# EAGLE design Minimal Breakout (EAGLE 6.4)
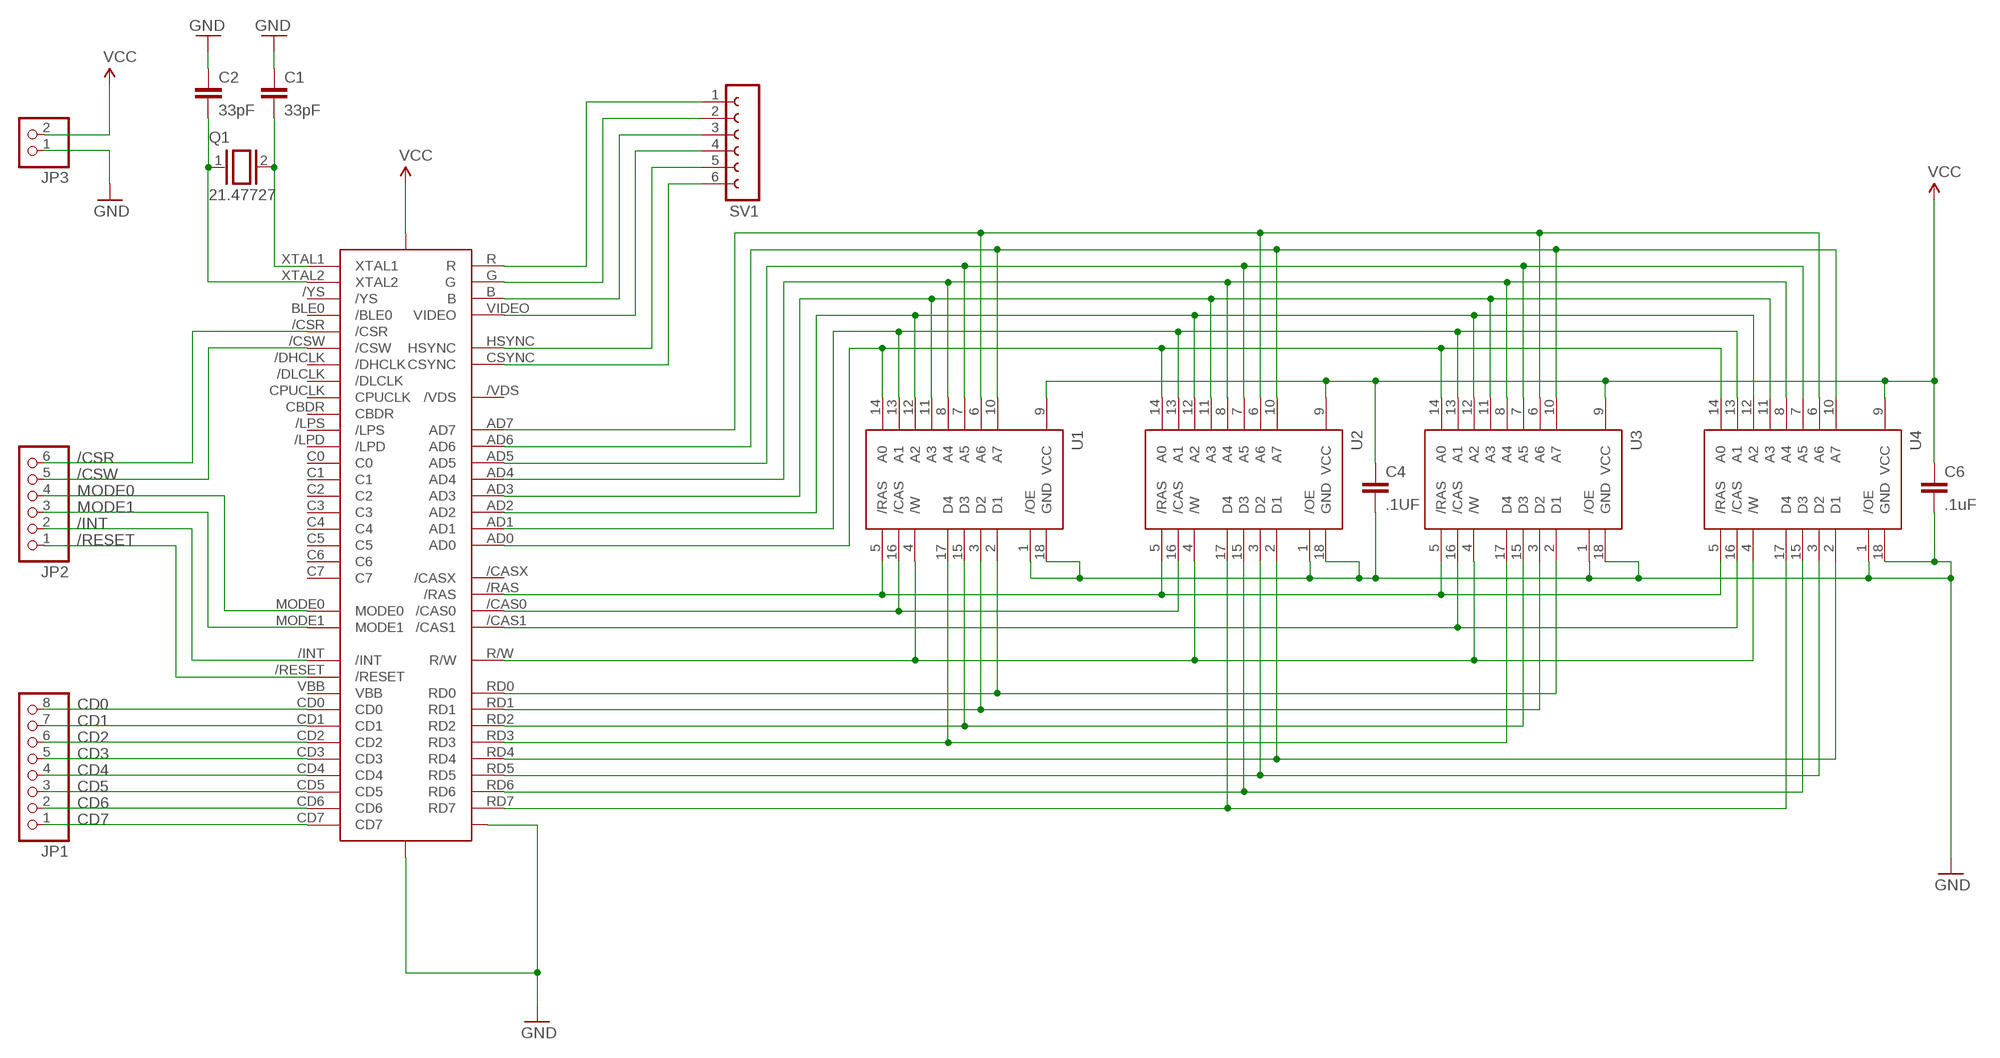
[diagram p0: schematic, sheet 1]

## Parts
C1  33pF  CAPEZ  [CAP-PTH-SMALLEZ]
C2  33pF  CAPEZ  [CAP-PTH-SMALLEZ]
C4  .1UF  CAPEZ  [CAP-PTH-SMALLEZ]
C6  .1uF  CAPEZ  [CAP-PTH-SMALLEZ]
JP1  PINHD-1X8  [1X08]
JP2  PINHD-1X6  [1X06]
JP3  PINHD-1X2  [1X02]
Q1  21.47727  XTAL  [Q]
SV1  FE06-1  [FE06]
U1  41464  [DIL18]
U2  41464  [DIL18]
U3  41464  [DIL18]
U4  41464  [DIL18]
V99X8  V99X8  [V99X8]

## Nets
/CAS0: U1.16(/CAS) U2.16(/CAS) V99X8./CAS0
/CAS1: U3.16(/CAS) U4.16(/CAS) V99X8./CAS1
/CSR: JP2.6 V99X8./CSR
/CSW: JP2.5 V99X8./CSW
/INT: JP2.2 V99X8./INT
/RAS: U1.5(/RAS) U2.5(/RAS) U3.5(/RAS) U4.5(/RAS) V99X8./RAS
/RESET: JP2.1 V99X8./RESET
AD0: U1.14(A0) U2.14(A0) U3.14(A0) U4.14(A0) V99X8.AD0
AD1: U1.13(A1) U2.13(A1) U3.13(A1) U4.13(A1) V99X8.AD1
AD2: U1.12(A2) U2.12(A2) U3.12(A2) U4.12(A2) V99X8.AD2
AD3: U1.11(A3) U2.11(A3) U3.11(A3) U4.11(A3) V99X8.AD3
AD4: U1.8(A4) U2.8(A4) U3.8(A4) U4.8(A4) V99X8.AD4
AD5: U1.7(A5) U2.7(A5) U3.7(A5) U4.7(A5) V99X8.AD5
AD6: U1.10(A7) U2.10(A7) U3.10(A7) U4.10(A7) V99X8.AD6
AD7: U1.6(A6) U2.6(A6) U3.6(A6) U4.6(A6) V99X8.AD7
B: SV1.3 V99X8.B
CD0: JP1.8 V99X8.CD0
CD1: JP1.7 V99X8.CD1
CD2: JP1.6 V99X8.CD2
CD3: JP1.5 V99X8.CD3
CD4: JP1.4 V99X8.CD4
CD5: JP1.3 V99X8.CD5
CD6: JP1.2 V99X8.CD6
CD7: JP1.1 V99X8.CD7
CSYNC: SV1.6 V99X8.CSYNC
G: SV1.2 V99X8.G
GND: C1.1 C2.1 C4.2 C6.2 JP3.1 U1.1(/OE) U1.18(GND) U2.1(/OE) U2.18(GND) U3.1(/OE) U3.18(GND) U4.1(/OE) U4.18(GND) V99X8.GND V99X8.GND/DAC(GNDDAC)
HSYNC: SV1.5 V99X8.HSYNC
MODE0: JP2.4 V99X8.MODE0
MODE1: JP2.3 V99X8.MODE1
N$1: C1.2 Q1.2 V99X8.XTAL1
N$2: C2.2 Q1.1 V99X8.XTAL2
R: SV1.1 V99X8.R
R/W: U1.4(/W) U2.4(/W) U3.4(/W) U4.4(/W) V99X8.R/W
RD0: U1.2(D1) U3.2(D1) V99X8.RD0
RD1: U1.3(D2) U3.3(D2) V99X8.RD1
RD2: U1.15(D3) U3.15(D3) V99X8.RD2
RD3: U1.17(D4) U3.17(D4) V99X8.RD3
RD4: U2.2(D1) U4.2(D1) V99X8.RD4
RD5: U2.3(D2) U4.3(D2) V99X8.RD5
RD6: U2.15(D3) U4.15(D3) V99X8.RD6
RD7: U2.17(D4) U4.17(D4) V99X8.RD7
VCC: C4.1 C6.1 JP3.2 U1.9(VCC) U2.9(VCC) U3.9(VCC) U4.9(VCC)
VIDEO: SV1.4 V99X8.VIDEO
Unconnected: V99X8./CASX V99X8./DHCLK V99X8./DLCLK V99X8./LPD V99X8./LPS V99X8./VDS V99X8./YS V99X8.BLE0(/BLE0) V99X8.C0 V99X8.C1 V99X8.C2 V99X8.C3 V99X8.C4 V99X8.C5 V99X8.C6 V99X8.C7 V99X8.CBDR V99X8.CPUCLK

## Power pins joined to a net without a drawn wire
VBB: V99X8.VBB
VCC: V99X8.VCC

## Library data of the parts
C1 C2 C4 C6 = SparkFun-Capacitors:CAP: Capacitor Standard 0603 ceramic capacitor, and 0.1" leaded capacitor.
JP1 = pinhead:PINHD-1X8: PIN HEADER
JP2 = pinhead:PINHD-1X6: PIN HEADER
JP3 = pinhead:PINHD-1X2: PIN HEADER
Q1 = special:XTAL: CRYSTAL
SV1 = con-lsta:FE06-1: FEMALE HEADER; OC_FARNELL: unknown; OC_NEWARK: unknown
U1-U4 = Benchoff:41464: 41464 64kx4 DRAM
V99X8 = Benchoff:V99X8: Yamaha V99X8 64 pin DIP V9918 V9938 V9958

## Board
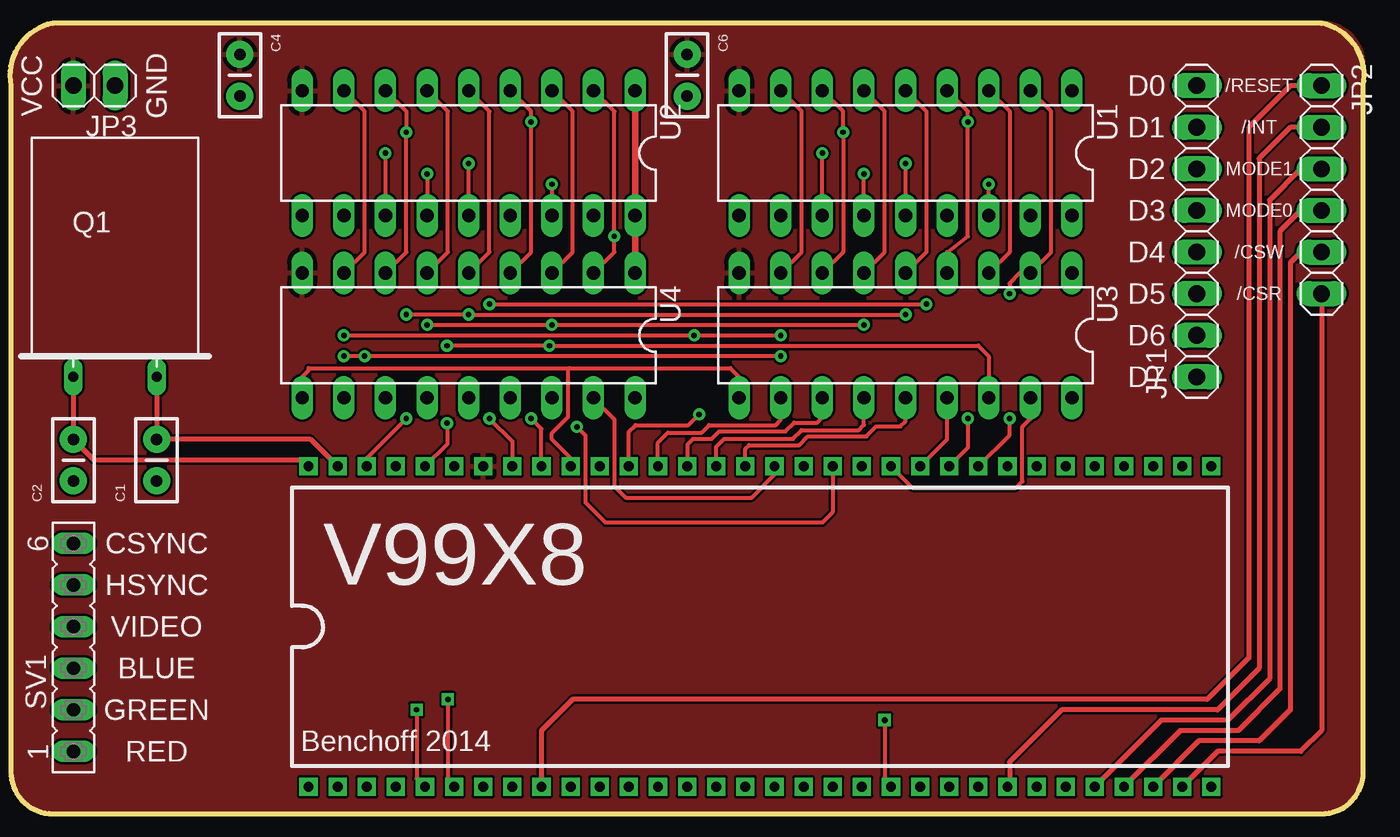
[diagram p1: board, top side]
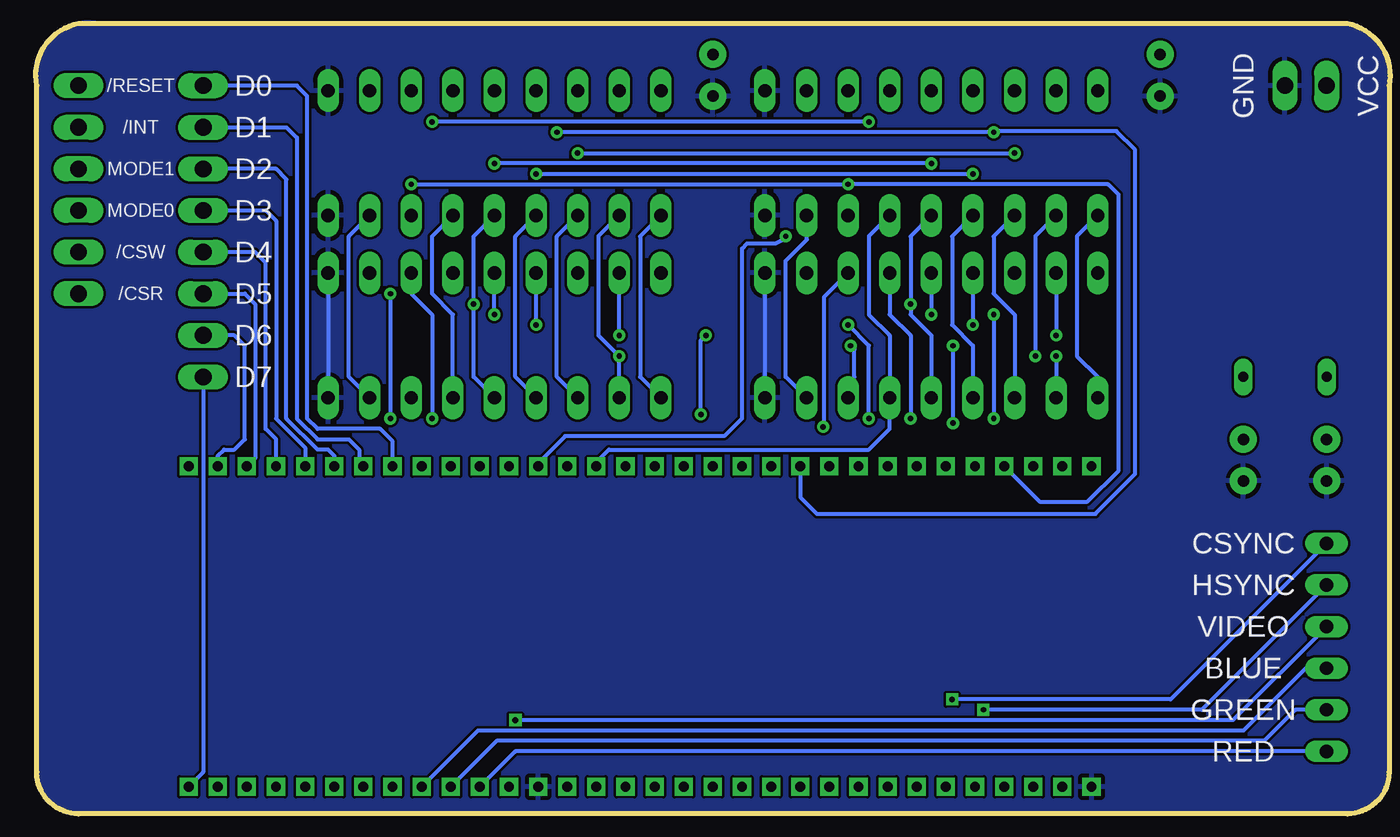
[diagram p2: board, bottom side, seen from below]

No outline drawn. Coordinates in mm, seen from the top.
Copper layers (1*16): Top 0.035mm / dielectric 1.5mm / Bottom 0.035mm
Design rules "default *": minimum track width 10mil, minimum drill 24mil, track to track 6mil, track to pad 6mil, pad to pad 6mil, via to via 6mil, smd to smd 6mil, copper to edge 40mil, drill to drill 8mil, minimum pad ring 10mil, minimum via ring 8mil, stop-mask expansion 15mil, vias tented up to drill 0mil, thermal gap 10mil
Milling: 8 lines

### Footprints (pad centres in the part's own frame; a part is rotated, then mirrored left to right if it is on the bottom)
CAP-PTH-SMALLEZ = drill 0.7 pad 1.651: 1 0,0; 2 2.54,0
1X08 = drill 1.016 long: 1 -8.89,0; 2 -6.35,0; 3 -3.81,0; 4 -1.27,0; 5 1.27,0; 6 3.81,0; 7 6.35,0; 8 8.89,0
1X06 = drill 1.016 long: 1 -6.35,0; 2 -3.81,0; 3 -1.27,0; 4 1.27,0; 5 3.81,0; 6 6.35,0
1X02 = drill 1.016 long: 1 -1.27,0; 2 1.27,0
Q = drill 0.61 long: 1 -2.54,-7.62; 2 2.54,-7.62
FE06 = drill 0.813 long: 1 -6.35,0; 2 -3.81,0; 3 -1.27,0; 4 1.27,0; 5 3.81,0; 6 6.35,0
DIL18 = drill 0.813 long: 1 -10.16,-3.81; 2 -7.62,-3.81; 3 -5.08,-3.81; 4 -2.54,-3.81; 5 0,-3.81; 6 2.54,-3.81; 7 5.08,-3.81; 8 7.62,-3.81; 9 10.16,-3.81; 10 10.16,3.81; 11 7.62,3.81; 12 5.08,3.81; 13 2.54,3.81; 14 0,3.81; 15 -2.54,3.81; 16 -5.08,3.81; 17 -7.62,3.81; 18 -10.16,3.81
V99X8 = drill 0.6 square: /CAS0 -22.225,9.779; /CAS1 -20.447,9.779; /CASX -18.669,9.779; /CSR 25.781,-9.779; /CSW 24.003,-9.779; /DHCLK -25.781,-9.779; /DLCLK -24.003,-9.779; /INT 15.113,-9.779; /LPD 18.669,-9.779; /LPS 16.891,-9.779; /RAS -24.003,9.779; /RESET -13.335,-9.779; /VDS -22.225,-9.779; /YS -11.557,-9.779; AD0 -0.889,9.779; AD1 -2.667,9.779; AD2 -4.445,9.779; AD3 -6.223,9.779; AD4 -8.001,9.779; AD5 -9.779,9.779; AD6 -11.557,9.779; AD7 -13.335,9.779; B 13.335,-9.779; BLE0 -16.891,-9.779; C0 4.445,-9.779; C1 2.667,-9.779; C2 0.889,-9.779; C3 -0.889,-9.779; C4 -2.667,-9.779; C5 -4.445,-9.779; C6 -6.223,-9.779; C7 -8.001,-9.779; CBDR -9.779,-9.779; CD0 15.113,9.779; CD1 16.891,9.779; CD2 18.669,9.779; CD3 20.447,9.779; CD4 22.225,9.779; CD5 24.003,9.779; CD6 25.781,9.779; CD7 27.559,-9.779; CPUCLK -15.113,-9.779; CSYNC -18.669,-9.779; G 11.557,-9.779; GND -27.559,-9.779; GND/DAC 6.223,-9.779; HSYNC -20.447,-9.779; MODE0 22.225,-9.779; MODE1 20.447,-9.779; R 9.779,-9.779; R/W -15.113,9.779; RD0 13.335,9.779; RD1 11.557,9.779; RD2 9.779,9.779; RD3 8.001,9.779; RD4 6.223,9.779; RD5 4.445,9.779; RD6 2.667,9.779; RD7 0.889,9.779; VBB 27.559,9.779; VCC -16.891,9.779; VIDEO 8.001,-9.779; XTAL1 -25.781,9.779; XTAL2 -27.559,9.779

### Placement (x,y rotation side)
C1  8.89,21.59 90 top
C2  3.81,21.59 90 top
C4  13.97,47.62 270 top
C6  41.27,47.62 270 top
JP1  72.39,36.83 90 top
JP2  80.01,39.37 270 top
JP3  5.08,45.72 180 top
Q1  6.35,35.56 0 top
SV1  3.81,11.43 90 top
U1  54.61,41.61 180 top
U2  27.94,41.61 180 top
U3  54.61,30.48 180 top
U4  27.94,30.48 180 top
V99X8  45.72,12.7 0 top

### Tracks (layer width: path | path; a pad name or v marks a point on that pad's centre or on a via)
/CAS0  (via drill 0.33)
  Top 0.254: U1.16 v59.69,39.7 | v33.02,39.7 U2.16
  Bottom 0.254: v59.69,39.7 v33.02,39.7 17.14,39.7 16.51,39.06 16.51,22.23 18.41,20.32 21.34,20.32 V99X8./CAS0
/CAS1  (via drill 0.33)
  Top 0.254: U3.16 59.69,29.21 59.05,29.84 v32.87,29.84 v26.62,29.84 | v26.62,25.12 26.62,23.82 V99X8./CAS1
  Bottom 0.254: U4.16 33.02,27.56 32.64,27.94 32.64,29.62 v32.87,29.84 | v26.62,29.84 v26.62,25.12
/CSR
  Top 0.305: JP2.6 80.01,6.35 78.74,5.08 73.66,5.08 V99X8./CSR
/CSW
  Top 0.305: JP2.5 78.74,35.56 78.11,34.92 78.11,7.62 76.2,5.71 72.52,5.71 V99X8./CSW
/INT
  Top 0.305: JP2.2 78.11,43.18 76.2,41.27 76.2,10.16 73.66,7.62 64.14,7.62 60.96,4.45 60.96,3.05 V99X8./INT
/RAS  (via drill 0.33)
  Top 0.254: U2.5 29.21,44.15 29.21,35.56 U4.5 | U1.5 55.88,44.15 55.88,35.56 U3.5 | v54.61,31.75 v27.94,31.75 v24.13,31.75 | v24.13,25.4 21.72,22.99 V99X8./RAS
  Bottom 0.254: U4.5 v27.94,31.75 | v54.61,31.75 U3.5 | v24.13,31.75 v24.13,25.4
/RESET
  Top 0.305: JP2.1 78.11,45.72 75.56,43.18 75.56,10.79 73.03,8.26 34.29,8.26 32.38,6.35 V99X8./RESET
AD0  (via drill 0.33)
  Top 0.254: v29.21,32.38 v55.88,32.38 | U2.14 v27.94,40.97 | U1.14 v54.61,40.97 | V99X8.AD0 44.83,23.55 45.06,23.77 48.11,23.77 48.64,24.31 52.22,24.31 52.83,24.92 54.29,24.92 54.61,25.23 U3.14
  Bottom 0.254: U3.14 55.88,27.94 v55.88,32.38 55.88,36.52 U1.14 | U2.14 29.21,36.52 v29.21,32.38 29.21,31.75 27.94,30.48 U4.14 | v27.94,40.97 v54.61,40.97
AD1  (via drill 0.33)
  Top 0.254: U1.13 v52.07,40.34 | v25.4,40.34 U2.13 | V99X8.AD1 43.05,23.67 43.54,24.16 47.73,24.16 48.26,24.69 51.75,24.69 52.07,25.01 U3.13
  Bottom 0.254: U3.13 53.34,27.94 53.34,36.52 U1.13 | U2.13 26.67,36.52 26.67,31.11 25.4,29.84 U4.13 | v52.07,40.34 v25.4,40.34
AD2  (via drill 0.33)
  Top 0.254: U1.12 v49.53,41.6 | v22.86,41.6 U2.12 | V99X8.AD2 41.33,22.53 41.33,23.84 41.64,24.16 42.77,24.16 43.23,24.61 47.27,24.61 47.8,25.15 49.21,25.15 49.53,25.46 U3.12
  Bottom 0.254: U2.12 24.13,36.52 24.13,33.02 22.86,31.75 U4.12 | U3.12 50.8,27.94 50.8,36.52 U1.12 | v49.53,41.6 v22.86,41.6
AD3  (via drill 0.33)
  Top 0.254: v46.99,29.21 v21.59,29.21 v20.32,29.21 | V99X8.AD3 39.5,23.93 40.11,24.54 42.16,24.54 42.62,24.99 46.67,24.99 46.99,25.31 U3.11
  Bottom 0.254: U1.11 48.26,36.52 48.26,30.48 v46.99,29.21 U3.11 | U2.11 21.59,36.52 v21.59,29.21 | v20.32,29.21 U4.11
AD4  (via drill 0.33)
  Top 0.254: U3.8 48.26,35.56 48.26,44.15 U1.8 | U2.8 21.59,44.15 21.59,35.56 U4.8 | v20.32,30.48 v41.71,30.48 v46.99,30.48 | V99X8.AD4 37.72,24.59 38.12,24.99 41.35,24.99 v42.01,25.65
  Bottom 0.254: U4.8 v20.32,30.48 | v46.99,30.48 U3.8 | v42.01,25.65 42.01,30.18 v41.71,30.48
AD5  (via drill 0.33)
  Top 0.254: U4.7 24.13,35.56 v24.13,42.88 24.13,44.15 U2.7 | U3.7 50.8,35.56 v50.8,42.88 50.8,44.15 U1.7
  Bottom 0.254: v50.8,42.88 v24.13,42.88 24.05,42.95 16.64,42.95 15.49,41.81 15.49,22.02 17.93,19.58 34.92,19.58 35.94,20.6 V99X8.AD5
AD6
  Top 0.254: 34.09,28.47 18.16,28.47 18.16,28.32 17.78,27.94 U4.10 | 34.09,28.47 43.92,28.47 44.53,27.86 44.53,26.75 U3.10 | V99X8.AD6 34.16,22.99 33.02,24.13 33.02,24.51 34.01,25.5 34.01,28.4 34.09,28.47
  Bottom 0.254: U1.10 45.72,36.52 45.72,27.94 U3.10 | U2.10 19.05,36.52 19.05,29.21 17.78,27.94 U4.10
AD7  (via drill 0.33)
  Top 0.254: U3.6 53.34,35.56 53.34,44.15 U1.6 | U2.6 26.67,44.15 26.67,35.56 U4.6 | v52.07,31.11 v33.02,31.11 v25.4,31.11 | V99X8.AD7 32.38,24.77 v31.75,25.4
  Bottom 0.254: v52.07,31.11 U3.6 | v31.75,25.4 31.75,29.84 v33.02,31.11 | U4.6 v25.4,31.11
B
  Bottom 0.254: SV1.3 5.08,10.16 8.89,6.35 55.63,6.35 V99X8.B
CD0
  Bottom 0.254: V99X8.CD0 60.83,24 61.59,24.77 65.41,24.77 66.04,25.4 66.04,45.09 66.67,45.72 JP1.8
CD1
  Bottom 0.254: JP1.7 67.31,43.18 66.67,42.55 66.67,25.4 65.41,24.13 63.5,24.13 62.87,23.5 62.87,22.73 V99X8.CD1
CD2
  Bottom 0.254: V99X8.CD2 64.39,23.11 64.77,23.5 65.41,23.5 67.31,25.4 67.31,40.01 67.94,40.64 JP1.6
CD3
  Bottom 0.254: JP1.5 68.58,38.1 67.94,37.47 67.94,25.4 66.17,23.62 V99X8.CD3
CD4
  Bottom 0.254: V99X8.CD4 67.94,24.13 68.58,24.77 68.58,34.92 69.22,35.56 JP1.4
CD5
  Bottom 0.254: JP1.3 69.85,33.02 69.22,32.38 69.22,22.99 V99X8.CD5
CD6
  Bottom 0.254: V99X8.CD6 71.5,23.11 71.12,23.5 70.48,23.5 69.85,24.13 69.85,29.84 70.48,30.48 JP1.2
CD7
  Bottom 0.254: JP1.1 72.39,3.81 V99X8.CD7
CSYNC  (via drill 0.33)
  Top 0.254: v26.67,8.26 26.67,3.3 V99X8.CSYNC
  Bottom 0.254: SV1.6 13.34,8.26 v26.67,8.26
G
  Bottom 0.254: SV1.2 5.71,7.62 7.62,5.71 54.48,5.71 V99X8.G
GND
  Top 0.406: U2.1 U2.18 U4.1
  Bottom 0.254: U3.1 U3.18 | U4.1 U4.18
  pour Bottom: 82.55,3.81 82.55,46.99 arc90 78.74,49.53 2.54,49.53 arc90 0,45.72 0,3.81 arc90 2.54,1.27 80.01,1.27 arc90
HSYNC  (via drill 0.33)
  Top 0.254: v24.77,7.62 24.77,3.43 V99X8.HSYNC
  Bottom 0.254: SV1.5 11.43,7.62 v24.77,7.62
MODE0
  Top 0.305: JP2.4 78.74,38.1 77.47,36.83 77.47,8.89 74.93,6.35 71.37,6.35 V99X8.MODE0
MODE1
  Top 0.305: JP2.3 78.74,40.64 76.83,38.73 76.83,9.53 74.3,6.99 70.23,6.99 V99X8.MODE1
N$1
  Top 0.305: Q1.2 C1.2 18.29,24.13 V99X8.XTAL1
N$2
  Top 0.305: Q1.1 C2.2 5.08,22.86 17.78,22.86 V99X8.XTAL2
R
  Bottom 0.254: SV1.1 53.34,5.08 V99X8.R
R/W  (via drill 0.33)
  Top 0.254: U1.4 58.42,44.15 v58.42,43.51 58.42,36.52 57.15,35.56 U3.4 | U4.4 31.75,35.56 v31.75,43.51 31.75,44.15 U2.4 | v29.21,25.4 30.61,24 V99X8.R/W
  Bottom 0.254: U4.4 30.48,31.75 29.21,30.48 v29.21,25.4 | v31.75,43.51 v58.42,43.51
RD0  (via drill 0.33)
  Top 0.254: U1.2 63.5,44.15 63.5,35.56 U3.2 61.59,34.29 60.96,33.66 v60.96,33.02 | V99X8.RD0 60.96,24.38 v60.96,25.4
  Bottom 0.254: v60.96,33.02 v60.96,25.4
RD1  (via drill 0.33)
  Top 0.254: U1.3 60.96,44.15 60.96,35.56 U3.3 | V99X8.RD1 58.42,23.62 v58.42,25.4
  Bottom 0.254: U3.3 59.69,33.02 58.42,31.75 v58.42,25.4
RD2
  Top 0.254: V99X8.RD2 57.15,24.13 U3.15
  Bottom 0.254: U1.15 58.42,36.52 58.42,33.02 57.15,31.75 U3.15
RD3
  Top 0.254: V99X8.RD3 55.02,21.18 61.37,21.18 61.75,21.57 61.75,24.89 62.23,25.38 U3.17
  Bottom 0.254: U3.17 63.5,27.94 63.5,36.52 U1.17
RD4  (via drill 0.33)
  Top 0.254: U4.2 36.83,35.56 v36.83,36.52 36.83,44.15 U2.2
  Bottom 0.254: v36.83,36.52 36.83,36.4 37.44,36.09 39.18,36.09 39.5,35.78 39.5,25.43 40.59,24.33 50.29,24.33 51.94,22.68 V99X8.RD4
RD5  (via drill 0.33)
  Top 0.254: U4.3 34.29,35.56 34.29,44.15 U2.3 | V99X8.RD5 50.16,19.68 49.53,19.05 36.3,19.05 35.08,20.27 35.08,24.36 v34.54,24.89
  Bottom 0.254: v34.54,24.89 34.47,24.97 34.47,32.84 U4.3
RD6
  Bottom 0.254: U2.15 31.75,36.52 31.75,31.75 30.48,30.48 U4.15 30.48,24.77 31.75,23.5 47.62,23.5 48.39,22.73 V99X8.RD6
RD7
  Top 0.254: V99X8.RD7 46.61,21.97 45.21,20.57 37.52,20.57 36.83,21.26 36.83,25.35 35.56,26.62 U4.17
  Bottom 0.254: U2.17 35.53,37.77 35.53,36.32 36.83,35.03 36.83,27.94 U4.17
VCC
  pour Top: 82.55,3.81 82.55,46.99 arc90 80.01,49.53 2.54,49.53 arc90 0,45.72 0,3.81 arc90 2.54,1.27 80.01,1.27 arc90
VIDEO  (via drill 0.36)
  Top 0.254: v53.34,6.99 53.34,3.3 V99X8.VIDEO
  Bottom 0.254: SV1.4 9.53,6.99 v53.34,6.99

### Text on the board
tPlace: VCC | GND | D0 | /RESET | D1 | /INT | D2 | MODE1 | D3 | MODE0 | D4 | /CSW | D5 | /CSR | D6 | D7 | CSYNC | HSYNC | VIDEO | BLUE | GREEN | Benchoff 2014 | RED
bPlace: VCC | GND | D0 | /RESET | D1 | /INT | D2 | MODE1 | D3 | MODE0 | D4 | /CSW | D5 | /CSR | D6 | D7 | CSYNC | HSYNC | VIDEO | BLUE | GREEN | RED